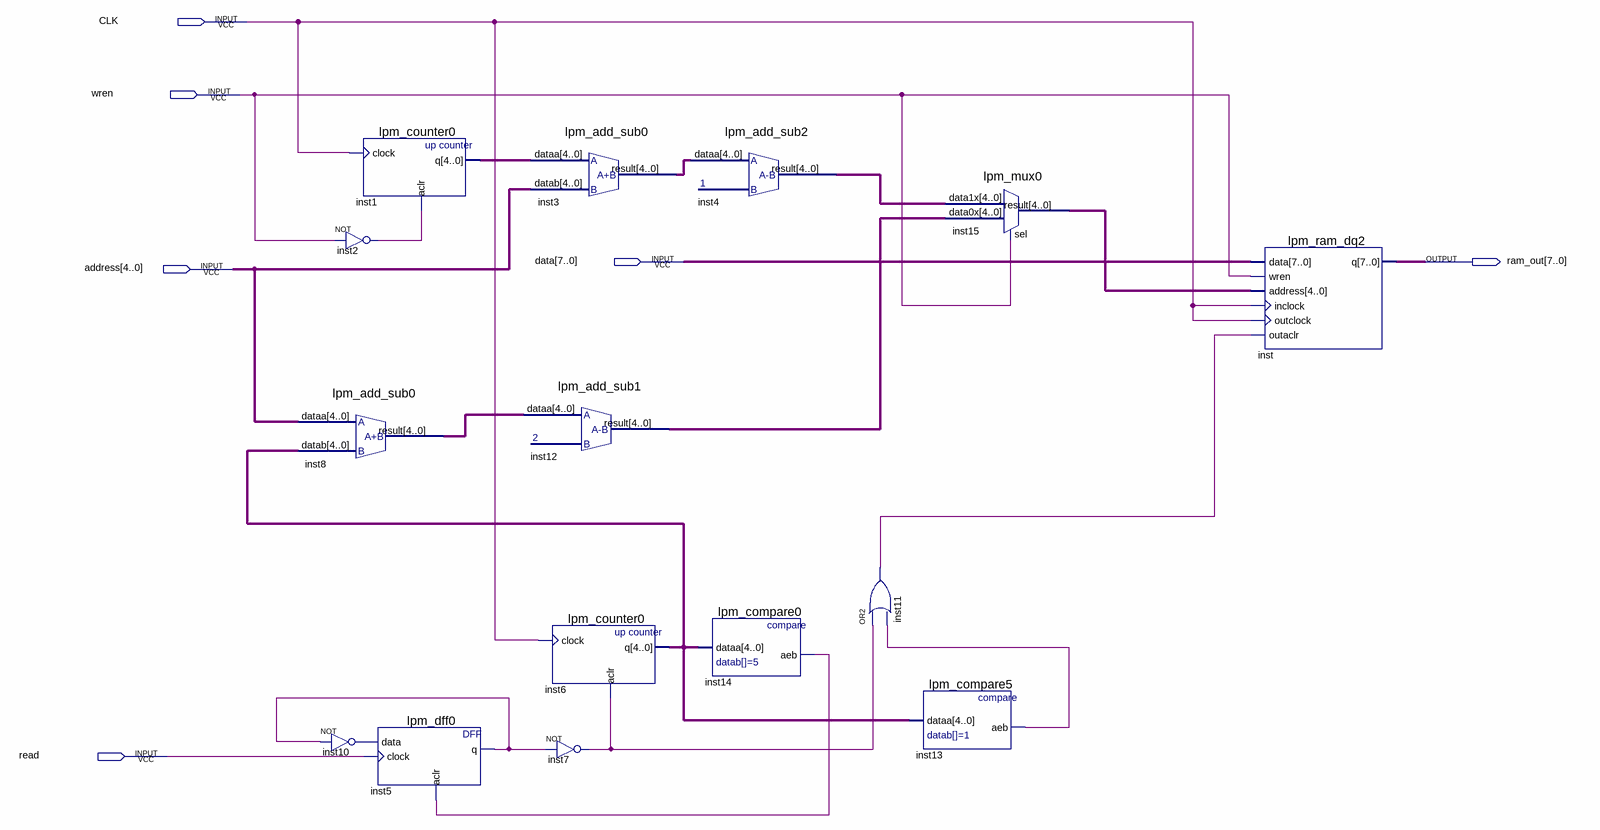
[diagram p0: schematic sheet]
// Quartus schematic ram_block.bdf as structural Verilog: 15 symbols, 6 pins
module ram_block (
  input  CLK,
  input  wren,
  input  [7:0] data,
  input  [4:0] address,
  input  read,
  output [7:0] ram_out
);

  wire inst2_out, inst5_q, inst7_out, inst10_out, inst11_out, inst13_aeb, inst14_aeb;
  wire [4:0] inst1_q, inst3_result, inst4_result, inst6_q, inst8_result, inst12_result, inst15_result;

  lpm_add_sub0 inst8 (.dataa(address), .datab(inst6_q), .result(inst8_result));
  not inst10 (inst10_out, inst5_q);
  lpm_counter0 inst1 (.clock(CLK), .aclr(inst2_out), .q(inst1_q));
  not inst2 (inst2_out, wren);
  lpm_dff0 inst5 (.data(inst10_out), .clock(read), .aclr(inst14_aeb), .q(inst5_q));
  lpm_add_sub0 inst3 (.dataa(inst1_q), .datab(address), .result(inst3_result));
  lpm_add_sub1 inst12 (.dataa(inst8_result), .result(inst12_result));
  lpm_counter0 inst6 (.clock(CLK), .aclr(inst7_out), .q(inst6_q));
  not inst7 (inst7_out, inst5_q);
  lpm_add_sub2 inst4 (.dataa(inst3_result), .result(inst4_result));
  lpm_compare0 inst14 (.dataa(inst6_q), .aeb(inst14_aeb));
  or inst11 (inst11_out, inst7_out, inst13_aeb);
  lpm_compare5 inst13 (.dataa(inst6_q), .aeb(inst13_aeb));
  lpm_mux0 inst15 (.data1x(inst4_result), .data0x(inst12_result), .sel(wren), .result(inst15_result));
  lpm_ram_dq2 inst (
    .data(data), .wren(wren), .address(inst15_result), .inclock(CLK), .outclock(CLK), .outaclr(inst11_out),
    .q(ram_out));
endmodule
